# EAGLE schematic electrosteel2020_10_arrange6_synthboardsonly3 (EAGLE 9.6.2)
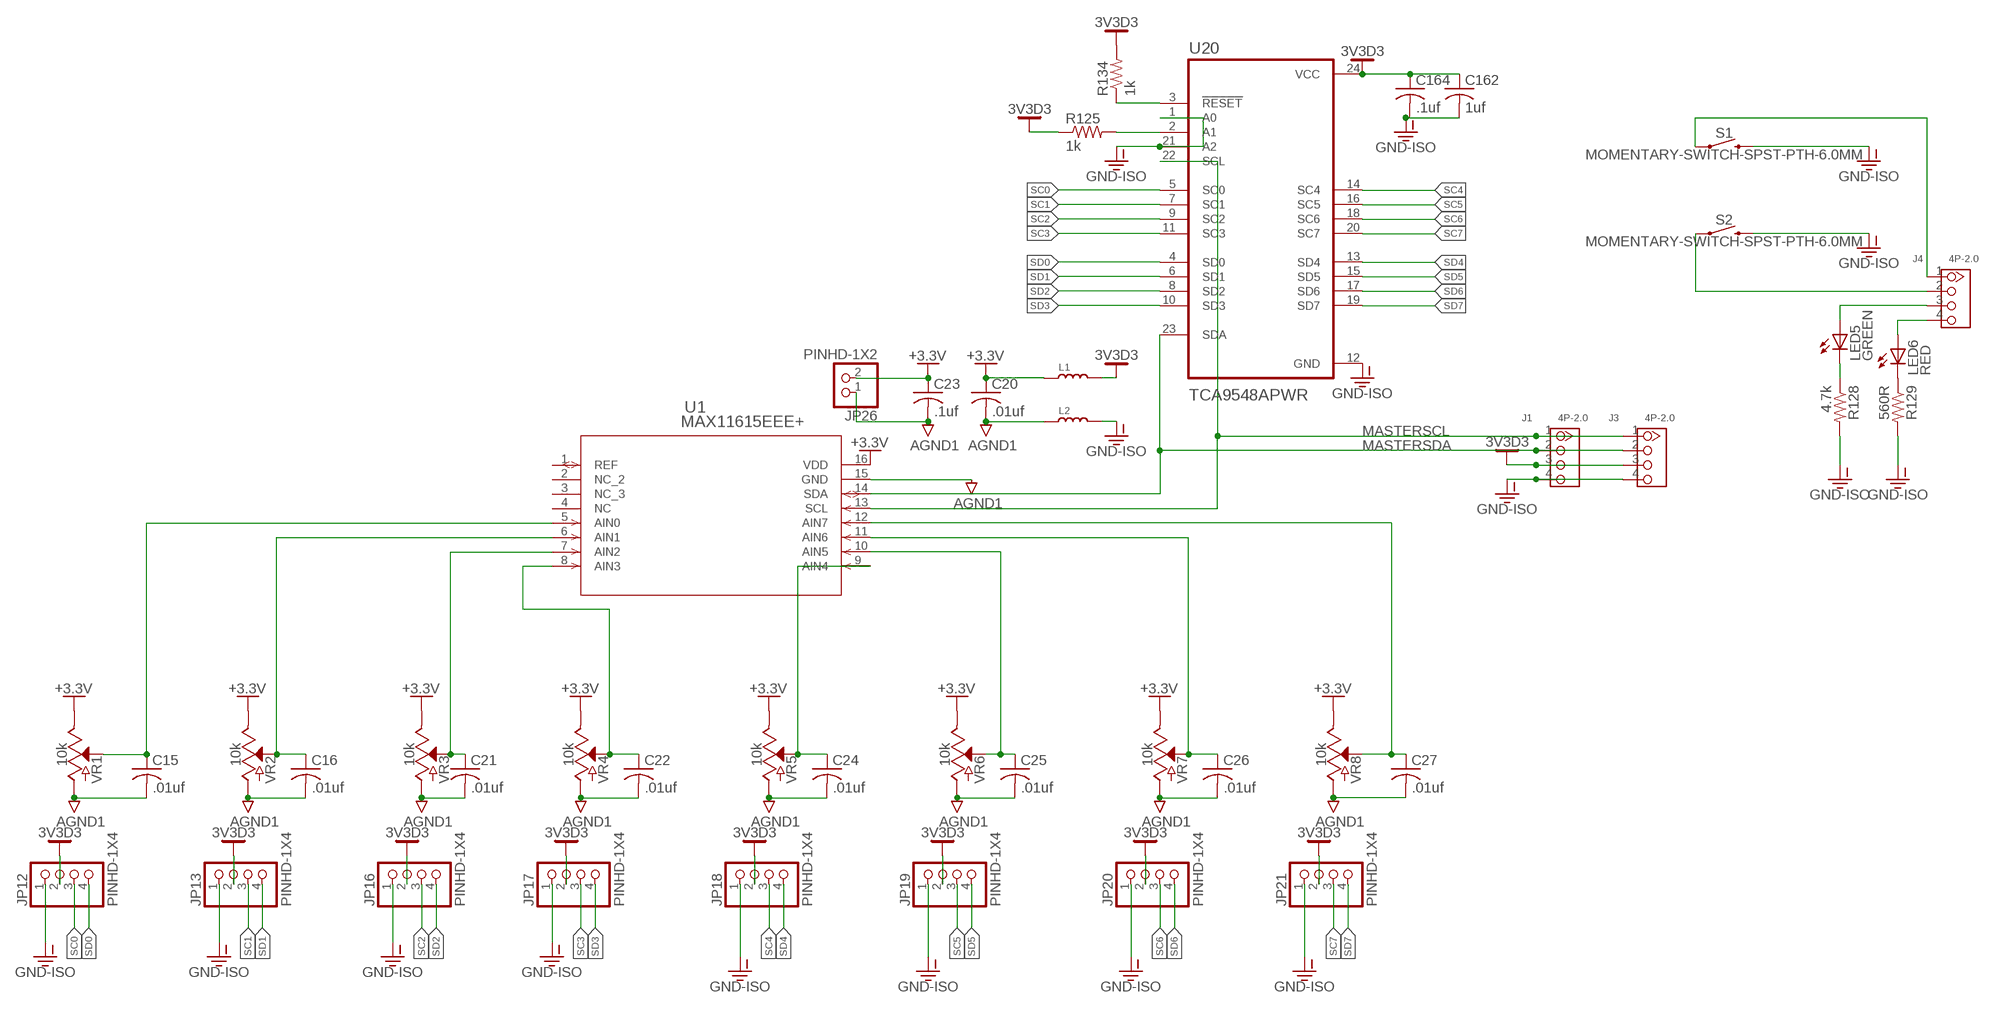
[diagram p0: schematic, sheet 1, part 1 of 2]
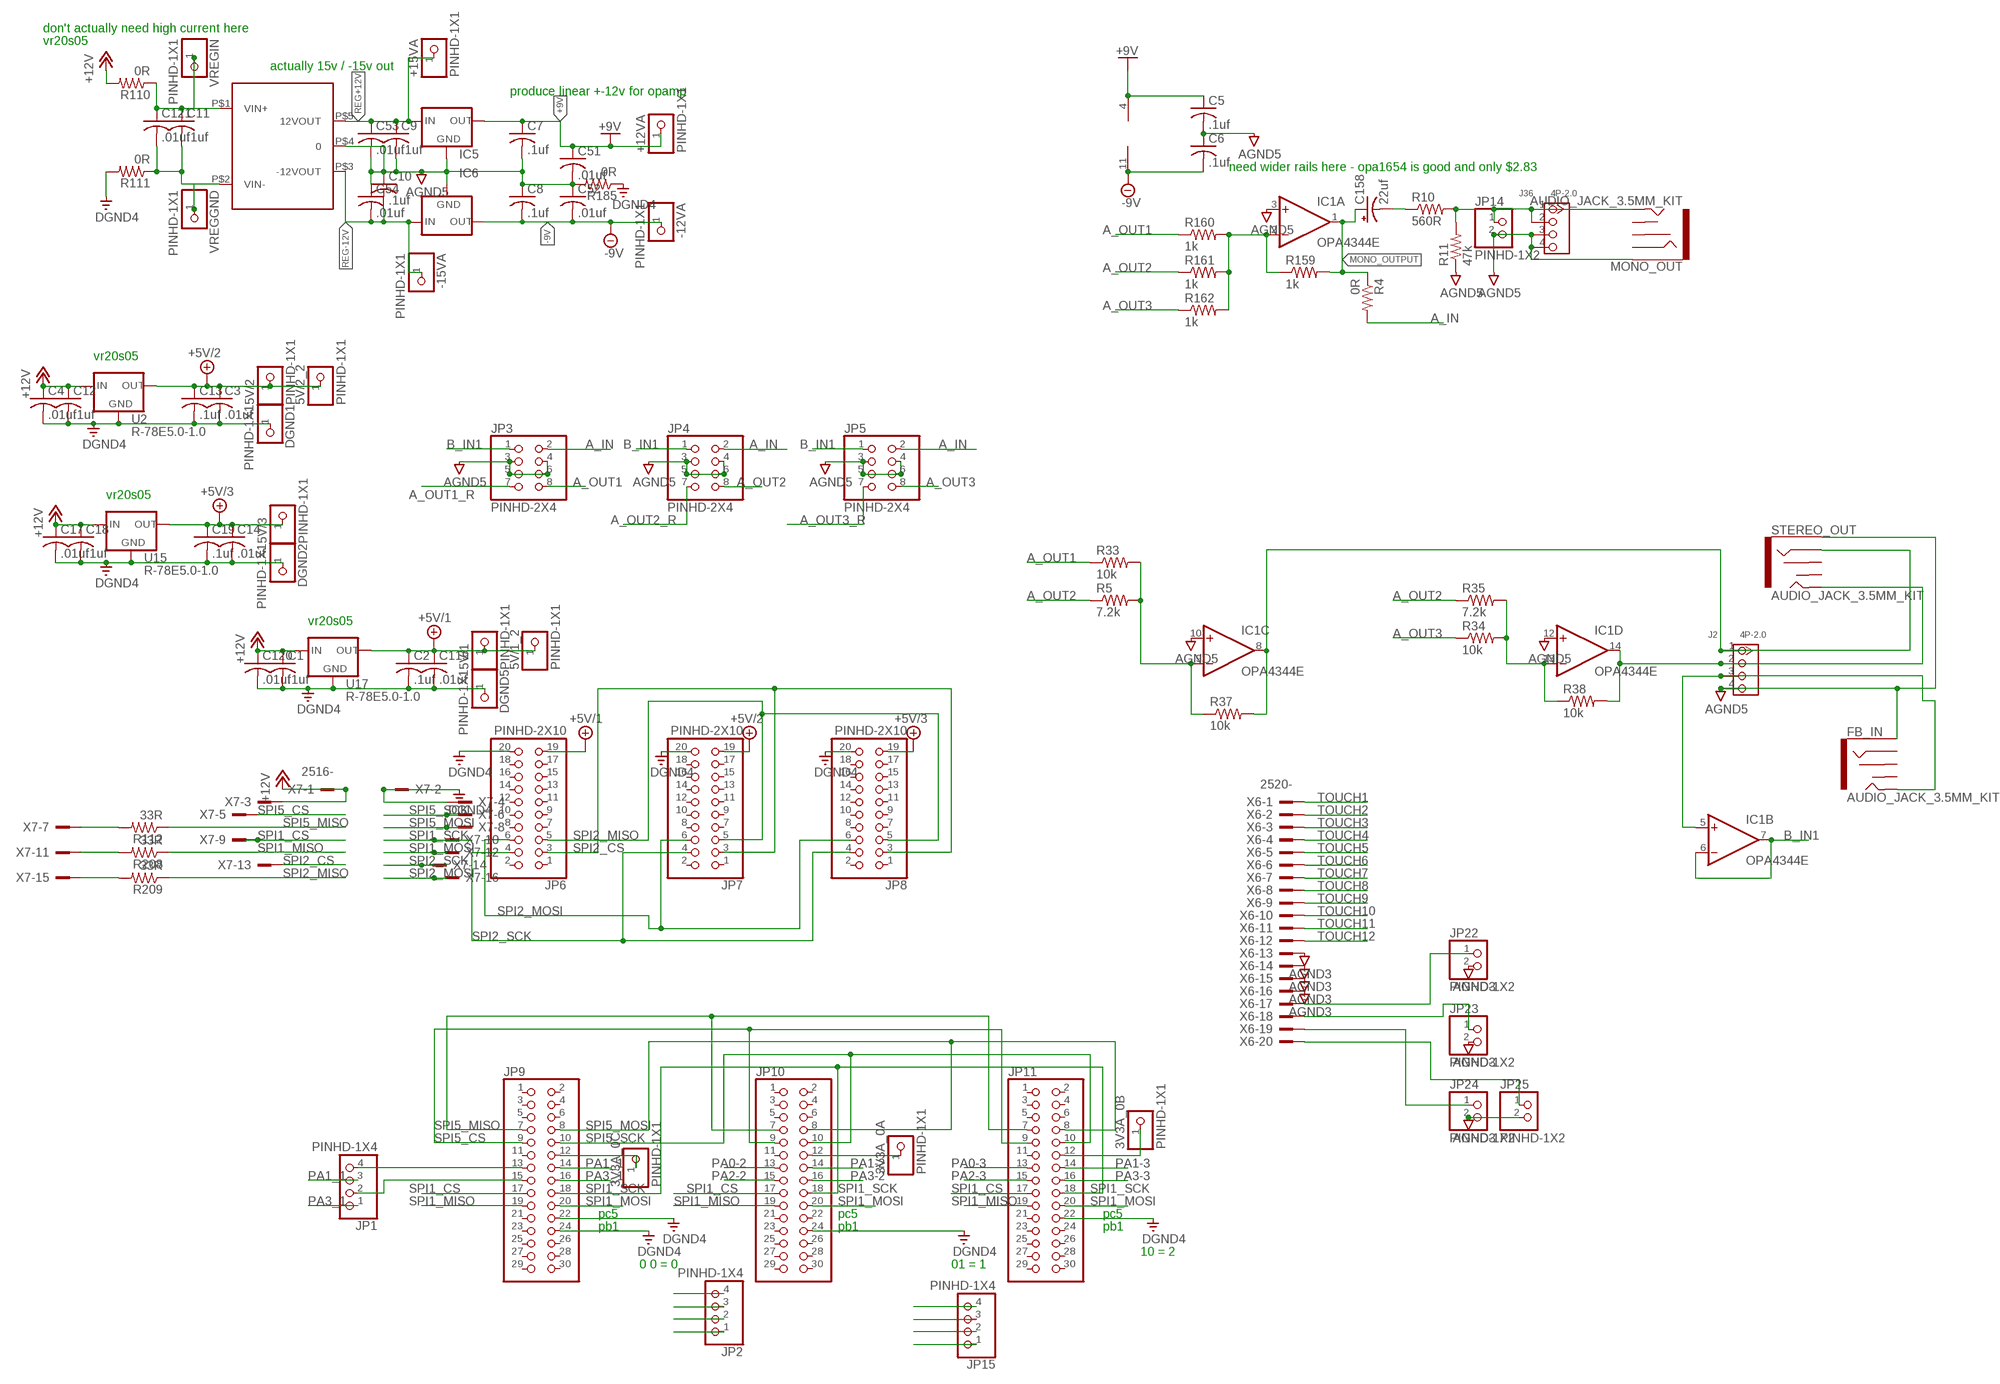
[diagram p1: schematic, sheet 1, part 2 of 2]

## Parts
3V3A_0A  PINHD-1X1  [1X01]
3V3A_0B  PINHD-1X1  [1X01]
3V3A_0C  PINHD-1X1  [1X01]
5V/1  PINHD-1X1  [1X01]
5V/1_2  PINHD-1X1  [1X01]
5V/2  PINHD-1X1  [1X01]
5V/2_2  PINHD-1X1  [1X01]
5V/3  PINHD-1X1  [1X01]
+12VA  PINHD-1X1  [1X01]
+15VA  PINHD-1X1  [1X01]
-12VA  PINHD-1X1  [1X01]
-15VA  PINHD-1X1  [1X01]
C1  .1uf  C-USC0603  [C0603]
C2  .1uf  C-USC0603  [C0603]
C3  .01uf  C-USC0603  [C0603]
C4  .01uf  C-USC0603  [C0603]
C5  .1uf  C-USC0603  [C0603]
C6  .1uf  C-USC0603  [C0603]
C7  .1uf  C-USC0603  [C0603]
C8  .1uf  C-USC0603  [C0603]
C9  .1uf  C-USC0603  [C0603]
C10  .1uf  C-USC0603  [C0603]
C11  .1uf  C-USC0603  [C0603]
C12  .1uf  C-USC0603  [C0603]
C13  .1uf  C-USC0603  [C0603]
C14  .01uf  C-USC0603  [C0603]
C15  .01uf  C-USC0603  [C0603]
C16  .01uf  C-USC0603  [C0603]
C17  .01uf  C-USC0603  [C0603]
C18  .1uf  C-USC0603  [C0603]
C19  .1uf  C-USC0603  [C0603]
C20  .01uf  C-USC0603  [C0603]
C21  .01uf  C-USC0603  [C0603]
C22  .01uf  C-USC0603  [C0603]
C23  .1uf  C-USC0603  [C0603]
C24  .01uf  C-USC0603  [C0603]
C25  .01uf  C-USC0603  [C0603]
C26  .01uf  C-USC0603  [C0603]
C27  .01uf  C-USC0603  [C0603]
C51  .01uf  C-USC0603  [C0603]
C52  .01uf  C-USC0603  [C0603]
C53  .01uf  C-USC0603  [C0603]
C54  .01uf  C-USC0603  [C0603]
C119  .01uf  C-USC0603  [C0603]
C120  .01uf  C-USC0603  [C0603]
C121  .01uf  C-USC0603  [C0603]
C158  22uf  CPOL-USD  [PANASONIC_D]
C162  1uf  C-USC1206K  [C1206K]
C164  .1uf  C-USC0603K  [C0603K]
DGND1  PINHD-1X1  [1X01]
DGND2  PINHD-1X1  [1X01]
DGND5  PINHD-1X1  [1X01]
FB_IN  AUDIO_JACK_3.5MM_KIT  [AUDIO-JACK-KIT]
IC1  OPA4344E  [TSSOP14]
IC5  78LXX  [78LXX]
IC6  79LXX  [79LXX]
J1  4P-2.0  GROVE-CONNECTOR-DIP(4P-2.0)  [HW4-2.0]
J2  4P-2.0  GROVE-CONNECTOR-DIP(4P-2.0)  [HW4-2.0]
J3  4P-2.0  GROVE-CONNECTOR-DIP(4P-2.0)  [HW4-2.0]
J4  4P-2.0  GROVE-CONNECTOR-DIP(4P-2.0)  [HW4-2.0]
J36  4P-2.0  GROVE-CONNECTOR-DIP(4P-2.0)  [HW4-2.0]
JP1  PINHD-1X4  [1X04]
JP2  PINHD-1X4  [1X04]
JP3  PINHD-2X4  [2X04]
JP4  PINHD-2X4  [2X04]
JP5  PINHD-2X4  [2X04]
JP6  PINHD-2X10  [2X10]
JP7  PINHD-2X10  [2X10]
JP8  PINHD-2X10  [2X10]
JP9  PINHD-2X15  [2X15]
JP10  PINHD-2X15  [2X15]
JP11  PINHD-2X15  [2X15]
JP12  PINHD-1X4  [1X04]
JP13  PINHD-1X4  [1X04]
JP14  PINHD-1X2  [1X02]
JP15  PINHD-1X4  [1X04]
JP16  PINHD-1X4  [1X04]
JP17  PINHD-1X4  [1X04]
JP18  PINHD-1X4  [1X04]
JP19  PINHD-1X4  [1X04]
JP20  PINHD-1X4  [1X04]
JP21  PINHD-1X4  [1X04]
JP22  PINHD-1X2  [1X02]
JP23  PINHD-1X2  [1X02]
JP24  PINHD-1X2  [1X02]
JP25  PINHD-1X2  [1X02]
JP26  PINHD-1X2  [1X02]
L1  INDUCTOR/FERRITE-BEAD0603  [INDUCTOR_L0603]
L2  INDUCTOR/FERRITE-BEAD0603  [INDUCTOR_L0603]
LED5  GREEN  LEDP-LCC-2  [P-LCC-2]
LED6  RED  LEDP-LCC-2  [P-LCC-2]
MONO_OUT  AUDIO_JACK_3.5MM_KIT  [AUDIO-JACK-KIT]
R4  0R  R-US_R0603  [R0603]
R5  7.2k  R-US_R0603  [R0603]
R10  560R  R-US_R0603  [R0603]
R11  47k  R-US_R0603  [R0603]
R33  10k  R-US_R0603  [R0603]
R34  10k  R-US_R0603  [R0603]
R35  7.2k  R-US_R0603  [R0603]
R37  10k  R-US_R0603  [R0603]
R38  10k  R-US_R0603  [R0603]
R110  0R  R-US_R0603  [R0603]
R111  0R  R-US_R0603  [R0603]
R112  33R  R-US_R0603  [R0603]
R125  1k  R-US_R0603  [R0603]
R128  4.7k  R-US_R0603  [R0603]
R129  560R  R-US_R0603  [R0603]
R134  1k  R-US_R0603  [R0603]
R159  1k  R-US_R0603  [R0603]
R160  1k  R-US_R0603  [R0603]
R161  1k  R-US_R0603  [R0603]
R162  1k  R-US_R0603  [R0603]
R185  0R  R-US_R0603  [R0603]
R208  33R  R-US_R0603  [R0603]
R209  33R  R-US_R0603  [R0603]
S1  MOMENTARY-SWITCH-SPST-PTH-6.0MM  [TACTILE_SWITCH_PTH_6.0MM]
S2  MOMENTARY-SWITCH-SPST-PTH-6.0MM  [TACTILE_SWITCH_PTH_6.0MM]
STEREO_OUT  AUDIO_JACK_3.5MM_KIT  [AUDIO-JACK-KIT]
U1  MAX11615EEE+  [21-0055H_16_MXM]
U2  R-78E5.0-1.0  [DC-DC_CONVERTER_78XX]
U15  R-78E5.0-1.0  [DC-DC_CONVERTER_78XX]
U17  R-78E5.0-1.0  [DC-DC_CONVERTER_78XX]
U20  TCA9548APWR  [SOP65P640X120-24N]
U$3  CMR0512S3C  [CMR0512S3C]
VR1  10k  POTENTIOMETER-PTH-9MM-1/20W-20%  [POT-PTH-ALPS]
VR2  10k  POTENTIOMETER-PTH-9MM-1/20W-20%  [POT-PTH-ALPS]
VR3  10k  POTENTIOMETER-PTH-9MM-1/20W-20%  [POT-PTH-ALPS]
VR4  10k  POTENTIOMETER-PTH-9MM-1/20W-20%  [POT-PTH-ALPS]
VR5  10k  POTENTIOMETER-PTH-9MM-1/20W-20%  [POT-PTH-ALPS]
VR6  10k  POTENTIOMETER-PTH-9MM-1/20W-20%  [POT-PTH-ALPS]
VR7  10k  POTENTIOMETER-PTH-9MM-1/20W-20%  [POT-PTH-ALPS]
VR8  10k  POTENTIOMETER-PTH-9MM-1/20W-20%  [POT-PTH-ALPS]
VREGGND  PINHD-1X1  [1X01]
VREGIN  PINHD-1X1  [1X01]
X6  2520-  [PAK100/2500-20]
X7  2516-  [PAK100/2500-16]

## Nets
3V3D3: C162.1 C164.1 J1.3 J3.3 JP12.2 JP13.2 JP16.2 JP17.2 JP18.2 JP19.2 JP20.2 JP21.2 L1.2 R125.1 R134.2 U20.24(VCC)
+3.3V: C20.1 C23.1 JP26.2 L1.1 U1.16(VDD) VR1.P$1(E) VR2.P$1(E) VR3.P$1(E) VR4.P$1(E) VR5.P$1(E) VR6.P$1(E) VR7.P$1(E) VR8.P$1(E)
+5V/1: 5V/1.1 5V/1_2.1 C2.1 C119.1 JP6.19 U17.VOUT(OUT)
+5V/2: 5V/2.1 5V/2_2.1 C3.1 C13.1 JP7.19 U2.VOUT(OUT)
+5V/3: 5V/3.1 C14.1 C19.1 JP8.19 U15.VOUT(OUT)
+9V: +12VA.1 C5.1 C7.1 C51.1 IC1.4(P:V+) IC5.OUT
+12V: C1.1 C4.1 C12.1 C17.1 C18.1 C120.1 R110.2 U2.VIN(IN) U15.VIN(IN) U17.VIN(IN) X7.1 X7.3
-9V: -12VA.1 C6.2 C8.2 C52.2 IC1.11(P:V-) IC6.OUT
A_IN: JP3.2 JP4.2 JP5.2 R4.2
A_OUT1: JP3.8 R33.1 R160.1
A_OUT1_R: JP3.7
A_OUT2: JP4.8 R5.1 R35.1 R161.1
A_OUT2_R: JP4.7
A_OUT3: JP5.8 R34.1 R162.1
A_OUT3_R: JP5.7
AGND1: C15.2 C16.2 C20.2 C21.2 C22.2 C23.2 C24.2 C25.2 C26.2 C27.2 JP26.1 L2.1 U1.15(GND) VR1.P$3(A) VR2.P$3(A) VR3.P$3(A) VR4.P$3(A) VR5.P$3(A) VR6.P$3(A) VR7.P$3(A) VR8.P$3(A)
AGND3: JP22.2 JP23.2 JP24.2 JP25.2 X6.13 X6.14 X6.15 X6.16
AGND5: C5.2 C6.1 C7.2 C8.1 C9.2 C10.1 C51.2 C52.1 C53.2 C54.1 FB_IN.SLEEVE IC1.3(A:+IN) IC1.10(C:+IN) IC1.12(D:+IN) IC5.GND IC6.GND J2.4 J36.3 J36.4 JP3.3 JP3.4 JP3.5 JP3.6 JP4.3 JP4.4 JP4.5 JP4.6 JP5.3 JP5.4 JP5.5 JP5.6 JP14.2 MONO_OUT.SLEEVE R11.1 R185.2 STEREO_OUT.SLEEVE U$3.P$4
B_IN1: IC1.6(B:-IN) IC1.7(B:OUT) JP3.1 JP4.1 JP5.1
DGND4: C1.2 C2.2 C3.2 C4.2 C12.2 C13.2 C14.2 C17.2 C18.2 C19.2 C119.2 C120.2 DGND1.1 DGND2.1 DGND5.1 JP6.20 JP7.20 JP8.20 JP9.22 JP9.24 JP10.24 JP11.22 R111.2 R185.1 U2.GND U15.GND U17.GND X7.2 X7.4
GND-ISO: C162.2 C164.2 J1.4 J3.4 JP12.1 JP13.1 JP16.1 JP17.1 JP18.1 JP19.1 JP20.1 JP21.1 L2.2 R128.2 R129.2 S1.3 S2.3 U20.1(A0) U20.12(GND) U20.21(A2)
MASTERSCL: J1.1 J3.1 U1.13(SCL) U20.22(SCL)
MASTERSDA: J1.2 J3.2 U1.14(SDA) U20.23(SDA)
MONO_OUTPUT: C158.+ IC1.1(A:OUT) R4.1 R159.2
N$1: LED5.C R128.1
N$3: C15.1 U1.5(AIN0) VR1.P$2(S)
N$4: C16.1 U1.6(AIN1) VR2.P$2(S)
N$5: C21.1 U1.7(AIN2) VR3.P$2(S)
N$6: C22.1 U1.8(AIN3) VR4.P$2(S)
N$7: J4.2 S2.1
N$8: C24.1 U1.9(AIN4) VR5.P$2(S)
N$9: C25.1 U1.10(AIN5) VR6.P$2(S)
N$10: J4.3 LED5.A
N$11: C26.1 U1.11(AIN6) VR7.P$2(S)
N$12: C27.1 U1.12(AIN7) VR8.P$2(S)
N$13: J4.4 LED6.A
N$15: R125.2 U20.2(A1)
N$16: IC1.9(C:-IN) R5.2 R33.2 R37.1
N$17: IC1.13(D:-IN) R34.2 R35.2 R38.1
N$18: IC1.14(D:OUT) J2.2 R38.2 STEREO_OUT.TIP
N$19: IC1.8(C:OUT) J2.1 R37.2 STEREO_OUT.RING
N$20: JP24.1 X6.19
N$21: FB_IN.TIP IC1.5(B:+IN) J2.3
N$22: JP25.1 X6.20
N$23: JP23.1 X6.18
N$24: JP22.1 X6.17
N$27: IC1.2(A:-IN) R159.1 R160.2 R161.2 R162.2
N$105: C11.2 C121.2 R111.1 U$3.P$2(VIN-) VREGGND.1
N$106: C11.1 C121.1 R110.1 U$3.P$1(VIN+) VREGIN.1
N$145: J4.1 S1.1
N$174: R134.1 U20.3(!RESET)
N$196: LED6.C R129.1
N$249: C158.- R10.1
N$265: J36.1 J36.2 JP14.1 MONO_OUT.TIP R10.2 R11.2
N$284: R209.2 X7.15
N$293: R208.2 X7.11
N$294: R112.2 X7.7
N$298: JP1.4 JP9.13
N$299: 3V3A_0C.1 JP9.12
N$300: JP1.2 JP9.15
N$309: 3V3A_0A.1 JP10.12
N$310: 3V3A_0B.1 JP11.12
PA0-2: JP2.4 JP10.13
PA0-3: JP11.13 JP15.4
PA1-2: JP2.3 JP10.14
PA1-3: JP11.14 JP15.3
PA1_1: JP1.3 JP9.14
PA2-2: JP2.2 JP10.15
PA2-3: JP11.15 JP15.2
PA3-2: JP2.1 JP10.16
PA3-3: JP11.16 JP15.1
PA3_1: JP1.1 JP9.16
REG+12V: +15VA.1 C9.1 C53.1 IC5.IN U$3.P$5(12VOUT)
REG-12V: -15VA.1 C10.2 C54.2 IC6.IN U$3.P$3(-12VOUT)
SC0: JP12.3 U20.5(SC0)
SC1: JP13.3 U20.7(SC1)
SC2: JP16.3 U20.9(SC2)
SC3: JP17.3 U20.11(SC3)
SC4: JP18.3 U20.14(SC4)
SC5: JP19.3 U20.16(SC5)
SC6: JP20.3 U20.18(SC6)
SC7: JP21.3 U20.20(SC7)
SD0: JP12.4 U20.4(SD0)
SD1: JP13.4 U20.6(SD1)
SD2: JP16.4 U20.8(SD2)
SD3: JP17.4 U20.10(SD3)
SD4: JP18.4 U20.13(SD4)
SD5: JP19.4 U20.15(SD5)
SD6: JP20.4 U20.17(SD6)
SD7: JP21.4 U20.19(SD7)
SPI1_CS: JP9.17 JP10.17 JP11.17 X7.9
SPI1_MISO: JP9.19 JP10.19 JP11.19 R208.1
SPI1_MOSI: JP9.20 JP10.20 JP11.20 X7.12
SPI1_SCK: JP9.18 JP10.18 JP11.18 X7.10
SPI2_CS: JP6.3 JP7.3 JP8.3 X7.13
SPI2_MISO: JP6.5 JP7.5 JP8.5 R209.1
SPI2_MOSI: JP6.6 JP7.6 JP8.6 X7.16
SPI2_SCK: JP6.4 JP7.4 JP8.4 X7.14
SPI5_CS: JP9.9 JP10.9 JP11.9 X7.5
SPI5_MISO: JP9.7 JP10.7 JP11.7 R112.1
SPI5_MOSI: JP9.8 JP10.8 JP11.8 X7.8
SPI5_SCK: JP9.10 JP10.10 JP11.10 X7.6
TOUCH1: X6.1
TOUCH2: X6.2
TOUCH3: X6.3
TOUCH4: X6.4
TOUCH5: X6.5
TOUCH6: X6.6
TOUCH7: X6.7
TOUCH8: X6.8
TOUCH9: X6.9
TOUCH10: X6.10
TOUCH11: X6.11
TOUCH12: X6.12
Unconnected: FB_IN.RING FB_IN.RSH FB_IN.TSH JP6.1 JP6.2 JP6.7 JP6.8 JP6.9 JP6.10 JP6.11 JP6.12 JP6.13 JP6.14 JP6.15 JP6.16 JP6.17 JP6.18 JP7.1 JP7.2 JP7.7 JP7.8 JP7.9 JP7.10 JP7.11 JP7.12 JP7.13 JP7.14 JP7.15 JP7.16 JP7.17 JP7.18 JP8.1 JP8.2 JP8.7 JP8.8 JP8.9 JP8.10 JP8.11 JP8.12 JP8.13 JP8.14 JP8.15 JP8.16 JP8.17 JP8.18 JP9.1 JP9.2 JP9.3 JP9.4 JP9.5 JP9.6 JP9.11 JP9.21 JP9.23 JP9.25 JP9.26 JP9.27 JP9.28 JP9.29 JP9.30 JP10.1 JP10.2 JP10.3 JP10.4 JP10.5 JP10.6 JP10.11 JP10.21 JP10.22 JP10.23 JP10.25 JP10.26 JP10.27 JP10.28 JP10.29 JP10.30 JP11.1 JP11.2 JP11.3 JP11.4 JP11.5 JP11.6 JP11.11 JP11.21 JP11.23 JP11.24 JP11.25 JP11.26 JP11.27 JP11.28 JP11.29 JP11.30 MONO_OUT.RING MONO_OUT.RSH MONO_OUT.TSH STEREO_OUT.RSH STEREO_OUT.TSH U1.1(REF) U1.2(NC_2) U1.3(NC_3) U1.4(NC)

## Notes on the sheet
- don't actually need high current here
- vr20s05
- actually 15v / -15v out
- produce linear +-12v for opamp
- need wider rails here - opa1654 is good and only $2.83
- vr20s05
- vr20s05
- vr20s05
- pc5 | pc5 | pc5
- pb1 | pb1 | pb1
- 10 = 2
- 0 0 = 0 | 01 = 1

## Library data of the parts
3V3A_0A 3V3A_0B 3V3A_0C 5V/1 5V/1_2 5V/2 5V/2_2 5V/3 +12VA +15VA -12VA -15VA DGND1 DGND2 DGND5 VREGGND VREGIN = Connector:PINHD-1X1: PIN HEADER; CATEGORY: CONNECTOR; PARTNO: *DNP; SUB-CATEGORY: PIN-HEADER
C1-C27 C51-C54 C119-C121 = rcl:C-US: CAPACITOR, American symbol; PARTNO: TMK063B7103KP-F; SPICEPREFIX: C
C158 = adafruit:CPOL-US: POLARIZED CAPACITOR, American symbol; PARTNO: EEE-1CA220NP
C162 = adafruit:C-US: CAPACITOR, American symbol; PARTNO: C3216X7R1E105K085AA
C164 = adafruit:C-US: CAPACITOR, American symbol; PARTNO: CC0603KRX7R8BB104
FB_IN MONO_OUT STEREO_OUT = SparkFun-Connectors:AUDIO_JACK_3.5MM: Audio Jack 3.5mm variants of PTH and SMT stereo audio jack with bypass switches. SparkFun Products: SparkFun SparkPunk Sound Kit <[https://www.sparkfun.com/products/11177]> - PTH MP3 Trigger <https://www.sparkfun.com/products/13720> -3.5mm SMD SparkFun PicoBoard <https://www.sparkfun.com/products/11888>- 2.5mm SMD; PROD_ID: CONN-08774; SF_ID: PRT-08032
IC1 = linear:OPA4*: Quad Operational Amplifier compatible with: TLC27L4 Low Power, Single-Supply, Rail-To-Rail Operational Amplifier Source: http://focus.ti.com/lit/ds/symlink/opa2345.pdf http://focus.ti.com .. opa241.pdf http://focus.ti.com .. tlc27l4.pdf http://focus.ti.com/lit/ds/symlink/opa2134.pdf; PARTNO: OPA1654AIPWR
IC5 = v-reg:78LXX: VOLTAGE REGULATOR; PARTNO: LM78L12ACZ/LFT7
IC6 = v-reg:79LXX: VOLTAGE REGULATOR; PARTNO: L79L12ACZ-TR
J1-J4 J36 = OPL_Connector:GROVE-CONNECTOR-DIP(4P-2.0): 320110033; PARTNO: 110990030
JP1 JP2 JP12 JP13 JP15-JP21 = Connector:PINHD-1X4: PIN HEADER; CATEGORY: CONNECTOR; SUB-CATEGORY: PIN-HEADER
JP3-JP5 = Connector:PINHD-2X4: PIN HEADER; CATEGORY: CONNECTOR; PARTNO: 77313-101-08LF; SUB-CATEGORY: PIN-HEADER
JP6-JP8 = Connector:PINHD-2X10: PIN HEADER; CATEGORY: CONNECTOR; PARTNO: 77313-101-20LF; SUB-CATEGORY: PIN-HEADER
JP9-JP11 = pinhead:PINHD-2X15: PIN HEADER; PARTNO: 77313-101-30LF
JP14 JP22-JP25 = Connector:PINHD-1X2: PIN HEADER; CATEGORY: CONNECTOR; PARTNO: *DNP; SUB-CATEGORY: PIN-HEADER
JP26 = Connector:PINHD-1X2: PIN HEADER; CATEGORY: CONNECTOR; SUB-CATEGORY: PIN-HEADER
L1 L2 = BeagleBone_Blue_R3:INDUCTOR/FERRITE-BEAD
LED5 = adafruit:LED: LED OSRAM: - CHIPLED LG R971, LG N971, LY N971, LG Q971, LY Q971, LO R971, LY R971 LH N974, LH R974 LS Q976, LO Q976, LY Q976 LO Q996 - Hyper CHIPLED LW Q18S LB Q993, LB Q99A, LB R99A - SideLED LS A670, LO A670, LY A670, LG A670, LP A670 LB A673, LV A673, LT A673, LW A673 LH A674 LY A675 LS A676, LA A676, LO A676, LY A676, LW A676 LS A679, LY A679, LG A679 - Hyper Micro SIDELED® LS Y876, LA Y876, LO Y876, LY Y876 LT Y87S - SmartLED LW L88C, LW L88S LB L89C, LB L89S, LG L890 LS L89K, LO L89K, LY L89K LS L896, LA L896, LO L896, LY L896 - TOPLED LS T670, LO T670, LY T670, LG T670, LP T670 LSG T670, LSP T670, LSY T670, LOP T670, LYG T670 LG T671, LOG T671, LSG T671 LB T673, LV T673, LT T673, LW T673 LH T674 LS T676, LA T676, LO T676, LY T676, LB T676, LH T676, LSB T676, LW T676 LB T67C, LV T67C, LT T67C, LS T67K, LO T67K, LY T67K, LW E67C LS E67B, LA E67B, LO E67B, LY E67B, LB E67C, LV E67C, LT E67C LW T67C LS T679, LY T679, LG T679 LS T770, LO T770, LY T770, LG T770, LP T770 LB T773, LV T773, LT T773, LW T773 LH T774 LS E675, LA E675, LY E675, LS T675 LS T776, LA T776, LO T776, LY T776, LB T776 LHGB T686 LT T68C, LB T68C - Hyper Mini TOPLED® LB M676 - Mini TOPLED Santana® LG M470 LS M47K, LO M47K, LY M47K Source: http://www.osram.convergy.de/; PARTNO: HSMM-A101-R00J1
LED6 = adafruit:LED: LED OSRAM: - CHIPLED LG R971, LG N971, LY N971, LG Q971, LY Q971, LO R971, LY R971 LH N974, LH R974 LS Q976, LO Q976, LY Q976 LO Q996 - Hyper CHIPLED LW Q18S LB Q993, LB Q99A, LB R99A - SideLED LS A670, LO A670, LY A670, LG A670, LP A670 LB A673, LV A673, LT A673, LW A673 LH A674 LY A675 LS A676, LA A676, LO A676, LY A676, LW A676 LS A679, LY A679, LG A679 - Hyper Micro SIDELED® LS Y876, LA Y876, LO Y876, LY Y876 LT Y87S - SmartLED LW L88C, LW L88S LB L89C, LB L89S, LG L890 LS L89K, LO L89K, LY L89K LS L896, LA L896, LO L896, LY L896 - TOPLED LS T670, LO T670, LY T670, LG T670, LP T670 LSG T670, LSP T670, LSY T670, LOP T670, LYG T670 LG T671, LOG T671, LSG T671 LB T673, LV T673, LT T673, LW T673 LH T674 LS T676, LA T676, LO T676, LY T676, LB T676, LH T676, LSB T676, LW T676 LB T67C, LV T67C, LT T67C, LS T67K, LO T67K, LY T67K, LW E67C LS E67B, LA E67B, LO E67B, LY E67B, LB E67C, LV E67C, LT E67C LW T67C LS T679, LY T679, LG T679 LS T770, LO T770, LY T770, LG T770, LP T770 LB T773, LV T773, LT T773, LW T773 LH T774 LS E675, LA E675, LY E675, LS T675 LS T776, LA T776, LO T776, LY T776, LB T776 LHGB T686 LT T68C, LB T68C - Hyper Mini TOPLED® LB M676 - Mini TOPLED Santana® LG M470 LS M47K, LO M47K, LY M47K Source: http://www.osram.convergy.de/; PARTNO: HSMZ-A100-R00J1
R4 R110 R111 R185 = Resistor:R-US_: RESISTOR, American symbol; PARTNO: RCS06030000Z0EA
R5 R33-R35 R37 R38 R125 R134 R159-R162 = Resistor:R-US_: RESISTOR, American symbol; PARTNO: ESR03EZPF1001
R10 R128 R129 = Resistor:R-US_: RESISTOR, American symbol; PARTNO: ESR03EZPF5600
R11 = Resistor:R-US_: RESISTOR, American symbol; PARTNO: ESR03EZPJ473
R112 R208 R209 = rcl:R-US_: RESISTOR, American symbol; PARTNO: RC0201FR-0733RL; SPICEPREFIX: R
S1 S2 = SparkFun-Switches:MOMENTARY-SWITCH-SPST: Momentary Switch (Pushbutton) - SPST Normally-open (NO) SPST momentary switches (buttons, pushbuttons). Variants PTH-12MM - 12mm square, through-hole Momentary Pushbutton Switch - 12mm Square <https://www.sparkfun.com/products/9190> (COM-09190) PTH-6.0MM, PTH-6.0MM-KIT - 6.0mm square, through-hole Mini Pushbutton Switch <https://www.sparkfun.com/products/97> (COM-00097) KIT package intended for soldering kit's - only one side of pads' copper is exposed. PTH-RIGHT-ANGLE-KIT - Right-angle, through-hole Right Angle Tactile Button <https://www.sparkfun.com/products/10791> - Used on SparkFun BigTime Watch Kit <https://www.sparkfun.com/products/11734> SMD-12MM - 12mm square, surface-mount Tactile Button - SMD (12mm) <https://www.sparkfun.com/products/12993> (COM-12993) Used on SparkFun PicoBoard <https://www.sparkfun.com/products/11888> SMD-4.5MM - 4.5mm Square Trackball Switch Used on SparkFun Blackberry Trackballer Breakout <https://www.sparkfun.com/products/13169> SMD-4.6MMX2.8MM - 4.60mm x 2.80mm, surface mount Used on SparkFun SAMD21 Mini Breakout <https://www.sparkfun.com/products/13664> SMD-5.2MM, SMD-5.2-REDUNDANT - 5.2mm square, surface-mount Mini Pushbutton Switch - SMD <https://www.sparkfun.com/products/8720> (COM-08720) Used on Arduino Pro Mini <https://www.sparkfun.com/products/11114> REDUNDANT package connects both switch circuits together SMD-6.0X3.5MM - 6.0 x 3.5mm, surface mount Momentary Reset Switch SMD <https://www.sparkfun.com/products/8229> (COM-08229) SMD-6.2MM-TALL - 6.2mm square, surface mount Tactile Button - SMD (6mm) <https://www.sparkfun.com/products/12992> Used on SparkFun Digital Sandbox <https://www.sparkfun.com/products/12651> SMD-RIGHT-ANGLE - Right-angle, surface mount Used on SparkFun Block for Intel® Edison - Arduino <https://www.sparkfun.com/products/13036>; PARTNO: TL1105SPF160Q; PROD_ID: SWCH-08441; SF_SKU: COM-00097
U1 = custom:MAX11615EEE+; BUILT_BY: EMA_UL_Team; MANUFACTURER_PART_NUMBER: max11615eee+; SOURCELIBRARY: Maxim_2009-12-17_3a; VENDOR: Maxim Integrated Products
U2 U15 U17 = SparkFun-IC-Power:R-78E5.0-1.0: Recom Power 5V 1A DC/DC Converter The Recom R-78E5.0-X.X is a compact DC/DC converter module that is a pin for pin drop-in replacement for the LM7805 linear voltage regulator. Specifications: Input Range: 7-28V Output Voltage: 5V Output Current: 1A Max Efficiency: 91% Datasheet <https://www.recom-power.com/pdf/Innoline/R-78Exx-1.0.pdf>; PARTNO: R-78E5.0-1.0; PROD_ID: COM-13655
U20 = TCA9548APWR:TCA9548APWR: Check prices <https://pricing.snapeda.com/parts/TCA9548APWR/Texas%20Instruments/view-part?ref=eda>; AVAILABILITY: Good; DESCRIPTION: Low-Voltage 8-Channel I2C Switch With Reset 24-TSSOP -40 to 85; MF: Texas Instruments; MP: TCA9548APWR; PACKAGE: TSSOP-24 Texas Instruments; PARTNO: TCA9548APWR; PRICE: None; PURCHASE-URL: https://pricing.snapeda.com/search/part/TCA9548APWR/?ref=eda
U$3 = custom:CMR0512S3C; PARTNO: DPU01M-15
VR1-VR8 = SparkFun-Resistors:POTENTIOMETER: Potentiometer (Pot) Three-terminal potentiometers, with an adjustable wiper and two adjustable resistors. A pot can be used to create a configurable voltage divider, or as a variable resistor. Variants ALPS_POT and ALPS_POT_KIT - PTH, breadboard compatible, 9mm square pots Rotary Potentiometer - Linear (10k ohm) <https://www.sparkfun.com/products/9288> (COM-09288) The KIT variant exposes copper on only one side of the PTH pad, so the part can only be assembled on one side of the PCB. Useful for beginner soldering kits.; PROD_ID: RES-09177; SF_SKU: COM-09288
X6 = con-3m:2520-: 3M (TM) Pak 100 4-Wall Header Source: 3M; OC_FARNELL: unknown; OC_NEWARK: unknown; PARTNO: N2520-6003-UG
X7 = con-3m:2516-: 3M (TM) Pak 100 4-Wall Header Source: 3M; OC_FARNELL: unknown; OC_NEWARK: unknown; PARTNO: D2516-6002-AR